# EAGLE design B008 - Xino RF v1.5 (EAGLE 6.1)
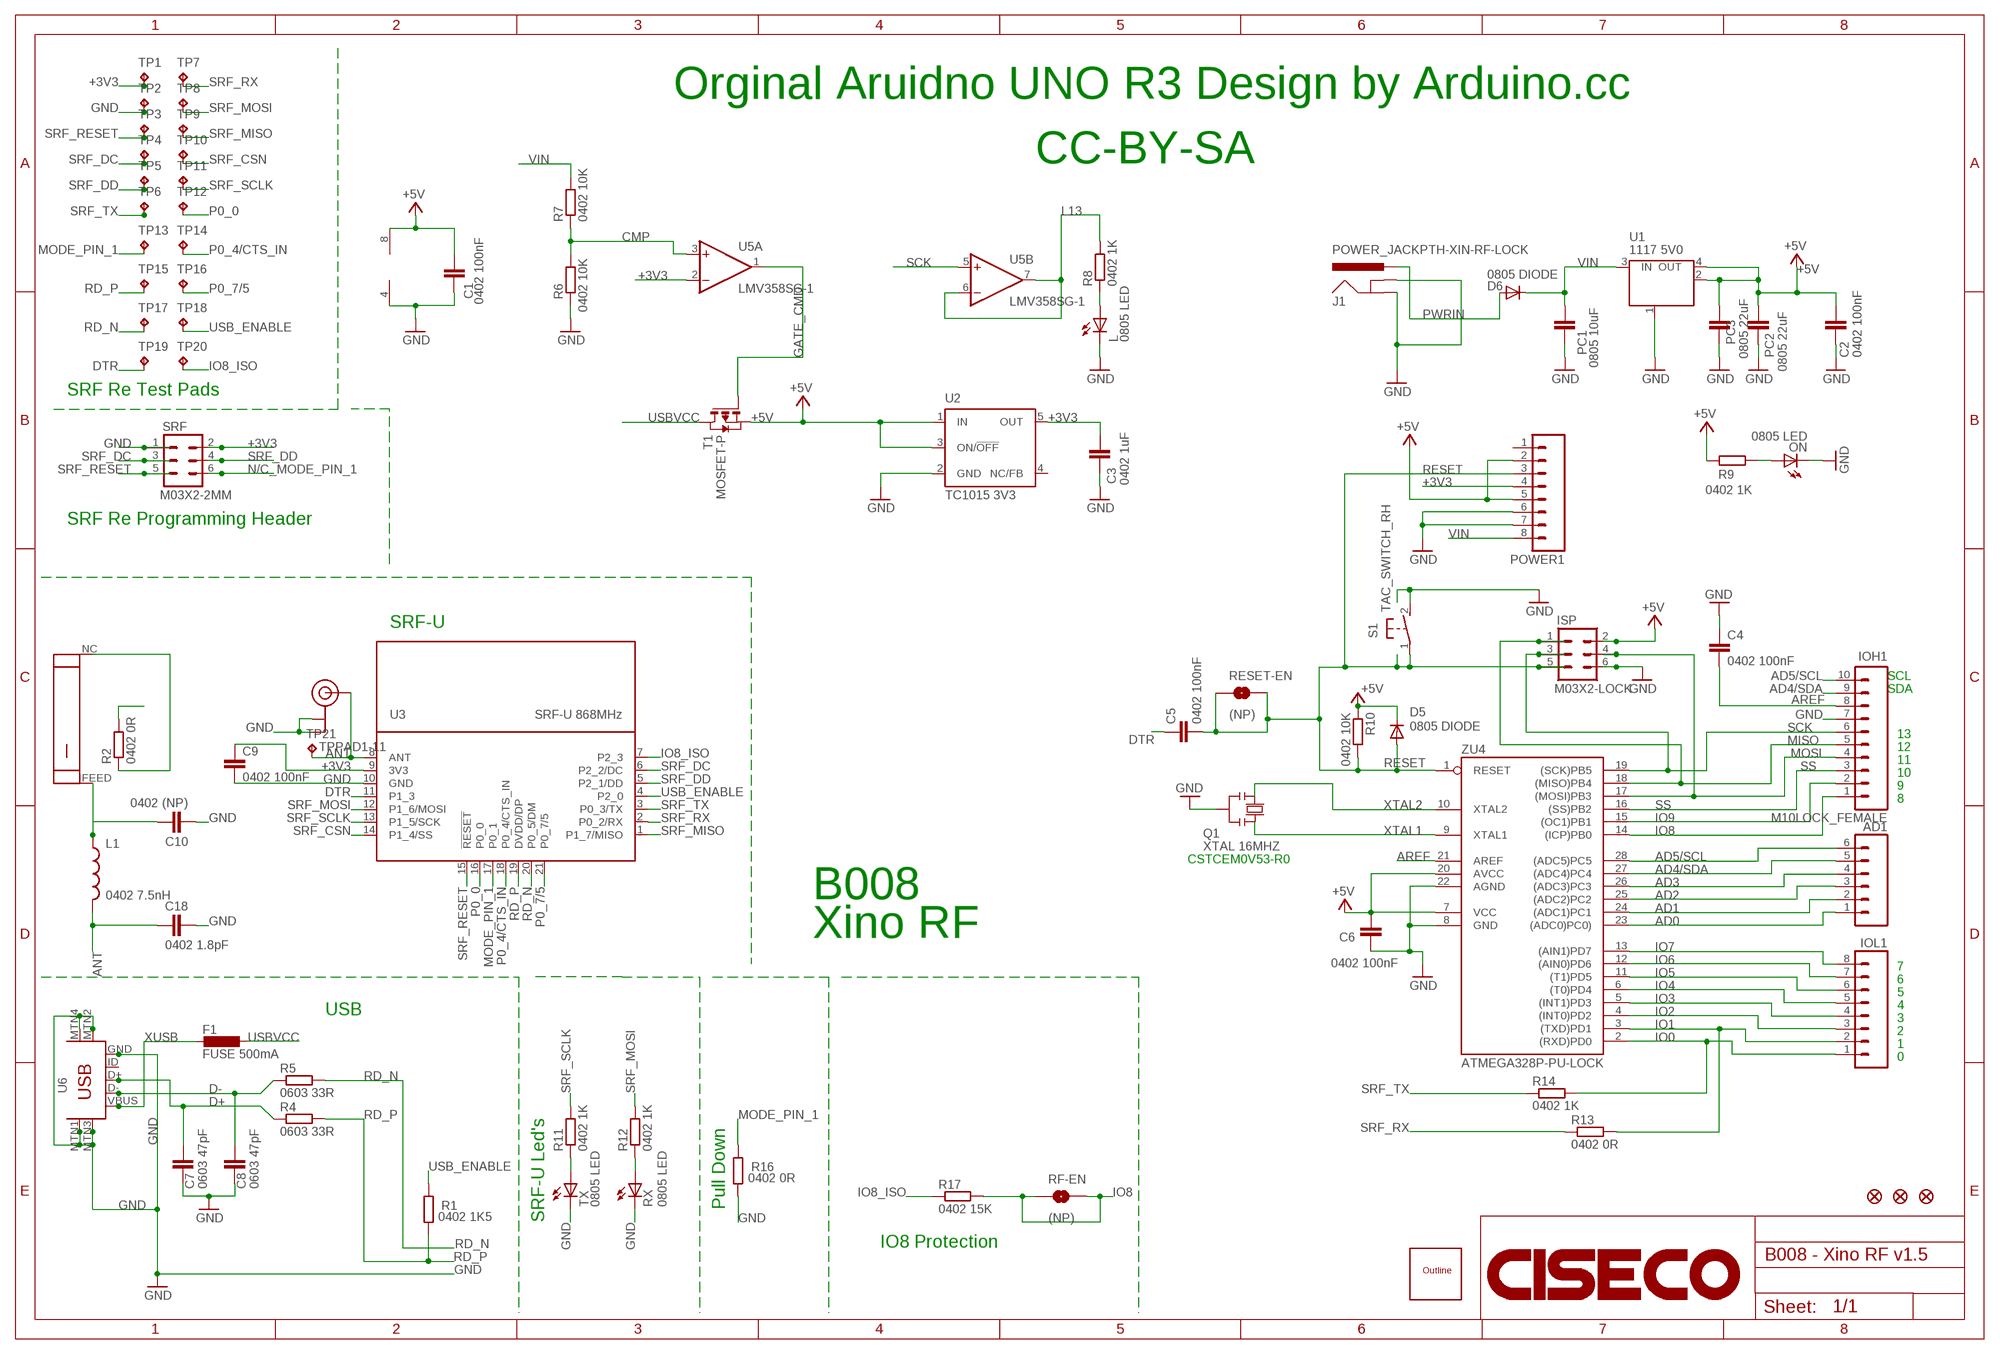
[diagram p0: schematic, sheet 1]

## Parts
AD1  M06LOCK_FEMALE  [1X06_LOCK_FEMALE]
C1  0402 100nF  C-EUC0402-SMALLER  [C0402-SMALLER]
C2  0402 100nF  C-EUC0402-SMALLER  [C0402-SMALLER]
C3  0402 1uF  C-EUC0402-SMALLER  [C0402-SMALLER]
C4  0402 100nF  C-EUC0402-SMALLER  [C0402-SMALLER]
C5  0402 100nF  C-EUC0402-SMALLER  [C0402-SMALLER]
C6  0402 100nF  C-EU0603-RND  [C0603-ROUND]
C7  0603 47pF  C-EUC0603K-SMALL  [C0603K-SMALL]
C8  0603 47pF  C-EUC0603K-SMALL  [C0603K-SMALL]
C9  0402 100nF  C-EUC0402-SMALLER  [C0402-SMALLER]
C10  0402 (NP)  C-EUC0402-SMALLER  [C0402-SMALLER]
C18  0402 1.8pF  C-EUC0402-SMALLER  [C0402-SMALLER]
D5  0805 DIODE  DIODE-0805  [0805-DIODE]
D6  0805 DIODE  DIODE-0805  [0805-DIODE]
F1  FUSE 500mA  L-EUL1812  [L1812]
FD1  FIDUCIAL1X2.5-STOP  [FIDUCIAL-1X2.5-STOP]
FD2  FIDUCIAL1X2.5-STOP  [FIDUCIAL-1X2.5-STOP]
FD3  FIDUCIAL1X2.5-STOP  [FIDUCIAL-1X2.5-STOP]
IOH1  M10LOCK_FEMALE  [1X10_LOCK_FEMALE]
IOL1  M08LOCK_FEMALE  [1X08_LOCK_FEMALE]
ISP  M03X2-LOCK  [2X3_LOCK]
J1  POWER_JACKPTH-XIN-RF-LOCK  [POWER_JACK_PTH_XINO_RF_LOCK]
L  0805 LED  LED0805-1206  [LED-0805-1206]
L1  0402 7.5nH  INDUCTOR0402-SMALLER  [C0402-SMALLER]
ON  0805 LED  LED0805-1206  [LED-0805-1206]
PC1  0805 10uF  C-EUC0805K  [C0805K]
PC2  0805 22uF  C-EUC0805K  [C0805K]
PC3  0805 22uF  C-EUC0805K  [C0805K]
POWER1  M08LOCK_FEMALE  [1X08_LOCK_FEMALE]
Q1  XTAL 16MHZ  RESONATORMU  [RESONATOR]
R1  0402 1K5  R-EU_R0402-SMALLER  [R0402-SMALLER]
R2  0402 0R  R-EU_R0402-SMALLER  [R0402-SMALLER]
R4  0603 33R  R-EU_0603K-SMALL  [C0603K-SMALL]
R5  0603 33R  R-EU_0603K-SMALL  [C0603K-SMALL]
R6  0402 10K  R-EU_R0402-SMALLER  [R0402-SMALLER]
R7  0402 10K  R-EU_R0402-SMALLER  [R0402-SMALLER]
R8  0402 1K  R-EU_R0402-SMALLER  [R0402-SMALLER]
R9  0402 1K  R-EU_R0402-SMALLER  [R0402-SMALLER]
R10  0402 10K  R-EU_R0402-SMALLER  [R0402-SMALLER]
R11  0402 1K  R-EU_R0402-SMALLER  [R0402-SMALLER]
R12  0402 1K  R-EU_R0402-SMALLER  [R0402-SMALLER]
R13  0402 0R  R-EU_R0402-SMALLER  [R0402-SMALLER]
R14  0402 1K  R-EU_R0402-SMALLER  [R0402-SMALLER]
R16  0402 0R  R-EU_R0402-SMALLER  [R0402-SMALLER]
R17  0402 15K  R-EU_R0402-SMALLER  [R0402-SMALLER]
RESET-EN  (NP)  SOLDERJUMPERNO-SJ  [SJ]
RF-EN  (NP)  SOLDERJUMPERNO-SJ  [SJ]
RX  0805 LED  LED0805-1206  [LED-0805-1206]
S1  TAC_SWITCH_RH  [B3F-31XX]
SRF  M03X2-2MM  [2X3_2MM]
T1  MOSFET-P  PMOSSOT23  [SOT-23]
TP1  TPB1,27  [B1,27]
TP2  TPB1,27  [B1,27]
TP3  TPB1,27  [B1,27]
TP4  TPB1,27  [B1,27]
TP5  TPB1,27  [B1,27]
TP6  TPB1,27  [B1,27]
TP7  TPB1,27  [B1,27]
TP8  TPB1,27  [B1,27]
TP9  TPB1,27  [B1,27]
TP10  TPB1,27  [B1,27]
TP11  TPB1,27  [B1,27]
TP12  TPB1,27  [B1,27]
TP13  TPB1,27  [B1,27]
TP14  TPB1,27  [B1,27]
TP15  TPB1,27  [B1,27]
TP16  TPB1,27  [B1,27]
TP17  TPB1,27  [B1,27]
TP18  TPB1,27  [B1,27]
TP19  TPB1,27  [B1,27]
TP20  TPB1,27  [B1,27]
TP21  TPPAD1-11  [P1-11]
TX  0805 LED  LED0805-1206  [LED-0805-1206]
U1  1117 5V0  MC33269ST-3.3T3  [SOT223]
U2  TC1015 3V3  LP2985-XXDBVR33  [SOT23-DBV]
U3  SRF-U 868MHz  SRF-LANDING-NO-ANT-1.2  [SRF-LANDING-NO-ANT-1.2]
U4  JTICHIPANT  JTICHIPANT-ROTATED  [JTICHIPANT-ROT]
U5  LMV358SG-1  LMV358MX  [SO08]
U6  USB-MINIB-5PIN  USB-MINIB-5PIN-TWEAKED  [USB-MINIB-CISECO-1]
U11  U.FL (NP)  U.FL  [U.FL]
U$1  CISECO-MEDIUM  [CISECO-1.3MM]
U$2  ARDUINO-OUTLINE-MILL-VSCORE  [ARDUINO-OUTLINE-MILL-VSCORE]
U$3  CISECO-LARGE  [CISECO-4MM]
ZU4  ATMEGA328P-PU-LOCK  [DIL28-3-LOCK]

## Nets
+3V3: C3.2 C9.1 POWER1.4 SRF.2 TP1.TP U2.5(OUT) U3.9(3V3) U5.2(A:-IN)
+5V [usbvcc]: C1.2 C2.2 C6.2 D5.C ISP.2 PC2.1 PC3.1 POWER1.2 POWER1.5 R9.2 R10.1 T1.2(S) U1.2(OUT) U1.4(OUT) U2.1(IN) U2.3(ON/!OFF) U5.8(P:V+) ZU4.7(VCC) ZU4.20(AVCC)
AD0: AD1.1 ZU4.23((ADC0)PC0))
AD1: AD1.2 ZU4.24((ADC1)PC1)
AD2: AD1.3 ZU4.25((ADC2)PC2)
AD3: AD1.4 ZU4.26((ADC3)PC3)
AD4/SDA: AD1.5 IOH1.9 ZU4.27((ADC4)PC4)
AD5/SCL: AD1.6 IOH1.10 ZU4.28((ADC5)PC5)
ANT [ANT]: C18.1 L1.2 TP21.TP U3.8(ANT) U11.P$3(SIGNAL)
AREF [aref]: C4.2 IOH1.8 ZU4.21(AREF)
CMP: R6.2 R7.1 U5.3(A:+IN)
D+: C7.1 R4.1 U6.D+
D-: C8.1 R5.1 U6.D-
DTR: C5.1 TP19.TP U3.11(P1_3)
GATE_CMD: T1.3(G) U5.1(A:OUT)
GND [gnd]: C1.1 C2.1 C3.1 C4.1 C6.1 C7.2 C8.2 C9.2 C10.1 C18.2 IOH1.7 ISP.6 J1.GND J1.GNDBREAK L.C ON.C PC1.2 PC2.2 PC3.2 POWER1.6 POWER1.7 Q1.2 R6.1 R16.1 RX.C S1.2(S) SRF.1 TP2.TP TX.C U1.1(GND/ADJ) U2.2(GND) U3.10(GND) U5.4(P:V-) U6.GND U6.MTN1(MTN2) U6.MTN2(MTN3) U6.MTN3(MTN1) U6.MTN4 U11.P$1(GND) U11.P$2(GND) ZU4.8(GND) ZU4.22(AGND)
IO0: IOL1.1 R14.2 ZU4.2((RXD)PD0)
IO1: IOL1.2 R13.2 ZU4.3((TXD)PD1)
IO2: IOL1.3 ZU4.4((INT0)PD2)
IO3: IOL1.4 ZU4.5((INT1)PD3)
IO4: IOL1.5 ZU4.6((T0)PD4)
IO5: IOL1.6 ZU4.11((T1)PD5)
IO6: IOL1.7 ZU4.12((AIN0)PD6)
IO7: IOL1.8 ZU4.13((AIN1)PD7)
IO8: IOH1.1 R17.2 RF-EN.1 RF-EN.2 ZU4.14((ICP)PB0)
IO8_ISO: R17.1 TP20.TP U3.7(P2_3)
IO9: IOH1.2 ZU4.15((OC1)PB1)
L13: R8.2 U5.6(B:-IN) U5.7(B:OUT)
MISO: IOH1.5 ISP.1 ZU4.18((MISO)PB4)
MODE_PIN_1: R16.2 TP13.TP U3.17(P0_1)
MOSI: IOH1.4 ISP.4 ZU4.17((MOSI)PB3)
N$1: L.A R8.1
N$3: ON.A R9.1
N$11: R2.2
N$35: R12.1 RX.A
N$36: R11.1 TX.A
N$39 [power]: C10.2 L1.1 U4.FEED
N$40: R2.1 U4.NC
N/C_MODE_PIN_1: SRF.6
P0_0: TP12.TP U3.16(P0_0)
P0_4/CTS_IN: TP14.TP U3.18(P0_4/CTS_IN)
P0_7/5: TP16.TP U3.21(P0_7/5)
PWRIN [power]: D6.A J1.PWR
RD_N [usb]: R5.2 TP17.TP U3.20(P0_5/DM)
RD_P [usb]: R1.1 R4.2 TP15.TP U3.19(DVDD/DP)
RESET: C5.2 D5.A ISP.5 POWER1.3 R10.2 RESET-EN.1 RESET-EN.2 S1.1(P) ZU4.1(RESET)
SCK: IOH1.6 ISP.3 U5.5(B:+IN) ZU4.19((SCK)PB5)
SRF_CSN: TP10.TP U3.14(P1_4/SS)
SRF_DC: SRF.3 TP4.TP U3.6(P2_2/DC)
SRF_DD: SRF.4 TP5.TP U3.5(P2_1/DD)
SRF_MISO: TP9.TP U3.1(P1_7/MISO)
SRF_MOSI: R12.2 TP8.TP U3.12(P1_6/MOSI)
SRF_RESET: SRF.5 TP3.TP U3.15(!RESET)
SRF_RX: R13.1 TP7.TP U3.2(P0_2/RX)
SRF_SCLK: R11.2 TP11.TP U3.13(P1_5/SCK)
SRF_TX: R14.1 TP6.TP U3.3(P0_3/TX)
SS: IOH1.3 ZU4.16((SS)PB2)
USB_ENABLE: R1.2 TP18.TP U3.4(P2_0)
USBVCC [usbvcc]: F1.1 T1.1(D)
VIN [power]: D6.C PC1.1 POWER1.8 R7.2 U1.3(IN)
XTAL1: Q1.3 ZU4.9(XTAL1)
XTAL2: Q1.1 ZU4.10(XTAL2)
XUSB [usbvcc]: F1.2 U6.VBUS
Unconnected: POWER1.1 U2.4(NC/FB) U6.ID

## Notes on the sheet
- Orginal Aruidno UNO R3 Design by Arduino.cc
- CC-BY-SA
- SRF Re Test Pads
- SRF Re Programming Header
- SRF-U
- SCL
- SDA
- 13
- 12
- 11
- 10
- 9
- 8
- CSTCEM0V53-R0
- B008
- Xino RF
- 7
- 6
- 5
- 4
- USB
- 3
- 2
- 1
- 0
- U6
- Pull Down
- SRF-U Led's
- IO8 Protection

## Library data of the parts
AD1 = CISECO eaglecad designs:M06: Header 6 Standard 6-pin 0.1" header. Use with straight break away headers (SKU : PRT-00116), right angle break away headers (PRT-00553), swiss pins (PRT-00743), machine pins (PRT-00117), and female headers (PRT-00115). Molex polarized connector foot print use with SKU : PRT-08094 with associated crimp pins and housings. NOTES ON THE VARIANTS LOCK and LOCK_LONGPADS... This footprint was designed to help hold the alignment of a through-hole component (i.e. 6-pin header) while soldering it into place. You may notice that each hole has been shifted either up or down by 0.005 of an inch from it's more standard position (which is a perfectly straight line). This slight alteration caused the pins (the squares in the middle) to touch the edges of the holes. Because they are alternating, it causes a "brace" to hold the component in place. 0.005 has proven to be the perfect amount of "off-center" position when using our standard breakaway headers. Although looks a little odd when you look at the bare footprint, once you have a header in there, the alteration is very hard to notice. Also, if you push a header all the way into place, it is covered up entirely on the bottom side. This idea of altering the position of holes to aid alignment will be further integrated into the Sparkfun Library for other footprints. It can help hold any component with 3 or more connection pins.
C1-C5 C7-C10 C18 PC1-PC3 = CISECO eaglecad designs:C-EU: CAPACITOR, European symbol
C6 = SmartPrj:C-EU: CAPACITOR, European symbol
D5 D6 = CISECO eaglecad designs:DIODE-: DIODE
F1 = rcl:L-EU: INDUCTOR, European symbol
FD1-FD3 = CISECO eaglecad designs:FIDUCIAL: Fiducial Alignment Points Various fiducial points for machine vision alignment.
IOH1 = CISECO eaglecad designs:M10: Header 10 Standard 10-pin 0.1" header. Use with straight break away headers (SKU : PRT-00116), right angle break away headers (PRT-00553), swiss pins (PRT-00743), machine pins (PRT-00117), and female headers (PRT-00115).
IOL1 POWER1 = CISECO eaglecad designs:M08: Header 8 Standard 8-pin 0.1" header. Use with straight break away headers (SKU : PRT-00116), right angle break away headers (PRT-00553), swiss pins (PRT-00743), machine pins (PRT-00117), and female headers (PRT-00115).
ISP SRF = CISECO eaglecad designs:M03X2
J1 = CISECO eaglecad designs:POWER_JACK: Power Jack This is the standard 5.5mm barrel jack for power. The PTH is the most common, proven, reliable, footprint. All others are experimental. The Slot footprint only works if the mill layer is transmitted to the PCB fab house so be warned. Spark Fun Electronics SKU : PRT-00119. Mating wall wart : TOL-00298 (and others)
L ON RX TX = CISECO eaglecad designs:LED: LEDs Standard schematic elements and footprints for 5mm, 3mm, 1206, and 0603 sized LEDs. 5mm - Spark Fun Electronics SKU : COM-00529 (and others)
L1 = CISECO eaglecad designs:INDUCTOR: Inductors Basic Inductor/Choke - 0603 and 1206. Footprints are not proven and vary greatly between part numbers.
Q1 = SmartPrj:RESONATOR
R1 R2 R4-R14 R16 R17 = CISECO eaglecad designs:R-EU_: RESISTOR, European symbol
RESET-EN RF-EN = CISECO eaglecad designs:SOLDERJUMPER: Solder Jumper Standard SMD solder jumper. Used to automate production. Two varients : Normally Open and Normally Closed are the same, but have different paste layers. NC will have a large amount of paste and should jumper during reflow.
S1 = CISECO eaglecad designs:TAC_SWITCH_RH
T1 = zetex:PMOSSOT23: MOS FET; OC_FARNELL: unknown; OC_NEWARK: unknown
TP1-TP20 = testpad:TP: Test pad
TP21 = CISECO eaglecad designs:TP: Test pad
U1 = CISECO eaglecad designs:MC33269ST*: Adjustable Output Low Dropout Voltage Regulator 800 mA Source: http://www.onsemi.com/pub/Collateral/MC33269-D.PDF LWK adjust for xino RF slik
U2 = SmartPrj:LP2985-XXDBVR: ULTRALOW-POWER 50-mA LOW-DROPOUT LINEAR REGULATORS 50-mA Low-Dropout Regulator Source: http://focus.ti.com/lit/ds/symlink/tps77001.pdf
U3 = Ciseco Footprints:SRF: SRF Wireless UART Serial Data Module. www.ciseco.co.uk
U4 = CISECO eaglecad designs:JTICHIPANT
U5 = linear:LMV358?*: Dual General Purpose, Low Voltage, Rail-to-Rail Output Operational Amplifiers Source: http://www.national.com/mpf/LM/LMV321.html http://www.national.com/dt/lmv_qual.pdf
U6 = CISECO eaglecad designs:USB-MINIB: Mini-USB "B" connector with 5th pin broken out. Created new symbol breaking out 5th "ID" pin in mini/micro USB connector spec. See: http://en.wikipedia.org/wiki/Mini_usb#Cables. Uses same footprint as 4-pin symbol. Also added pins to connect to mounting / shield pads if required (probably not generally needed as signals aren't shielded once they leave the connector). Modified by Ciseco for Rapid Part 24-0357
U11 = CISECO eaglecad designs:U.FL
U$1 U$3 = CISECO eaglecad designs:CISECO
U$2 = CISECO eaglecad designs:ARDUINO-OUTLINE
ZU4 = CISECO eaglecad designs:ATMEGA328P-: MICROCONTROLLER 4 Kbytes FLASH 128 bytes SRAM 256 bytes EEPROM UART 6-channel 10 bit ADC

## Net classes
0 default: width 0.254 mm, clearance 0.254 mm
1 power: width 0.61 mm, drill 0.406 mm, clearance 0.254 mm
2 gnd: width 0.305 mm, drill 0.254 mm, clearance 0.254 mm
3 usbvcc: width 0.508 mm, drill 0.406 mm, clearance 0.254 mm
4 aref: width 0.406 mm, drill 0.406 mm, clearance 0.254 mm
5 usb: width 0.254 mm, clearance 0.254 mm
6 ANT: width 0.61 mm, drill 0.254 mm, clearance 0.381 mm

## Board
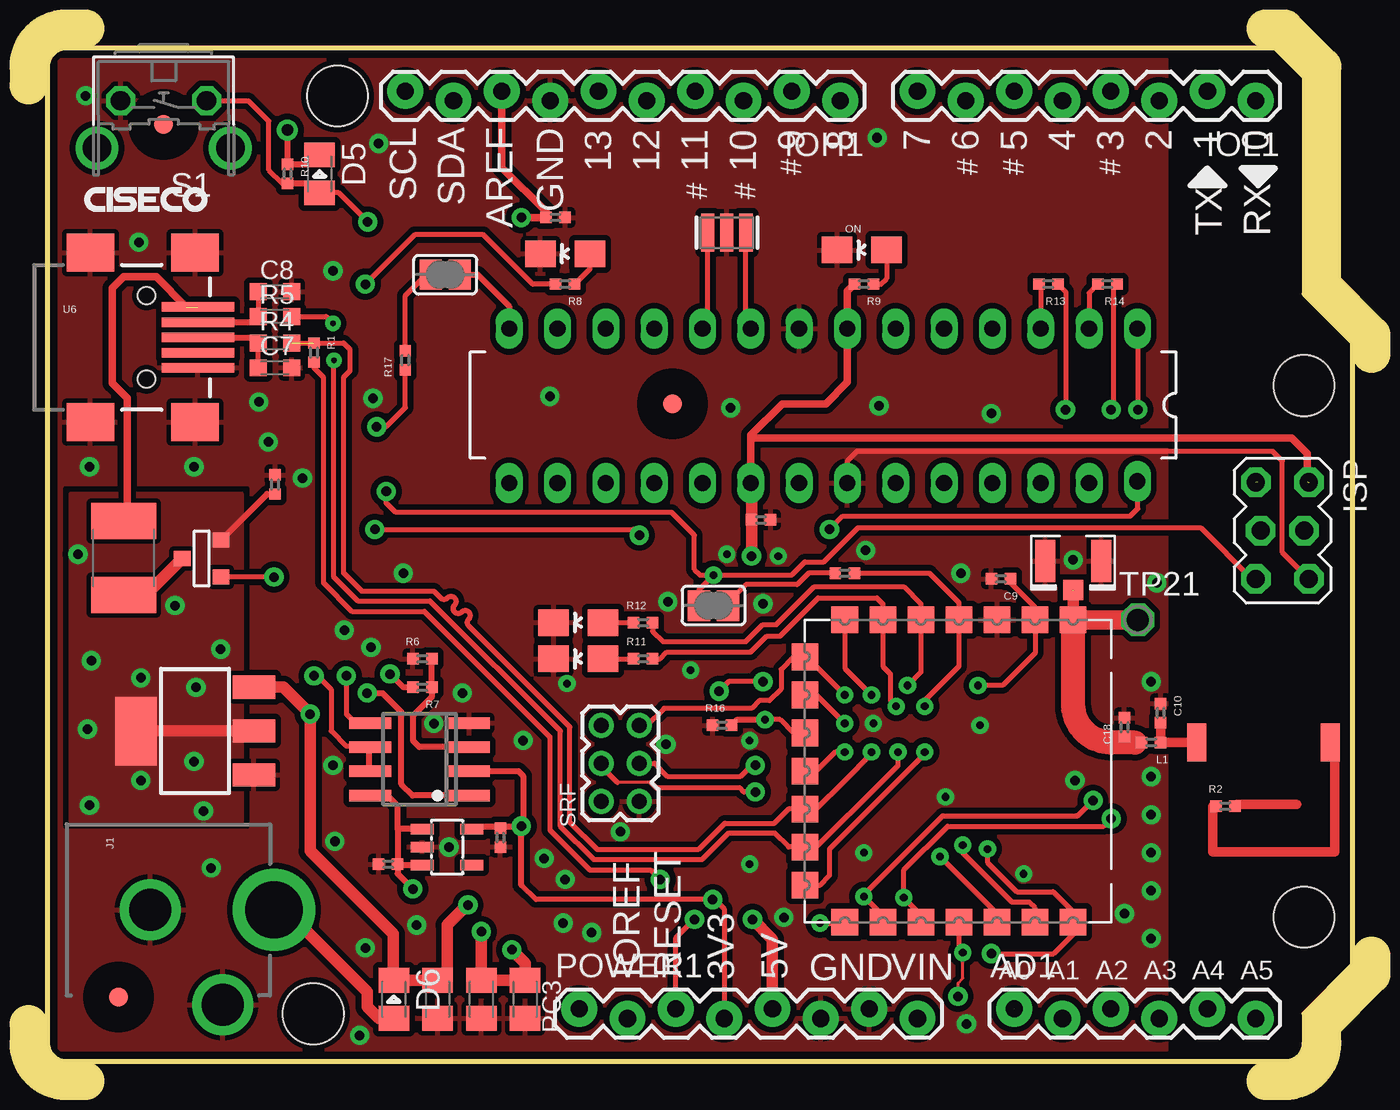
[diagram p1: board, top side]
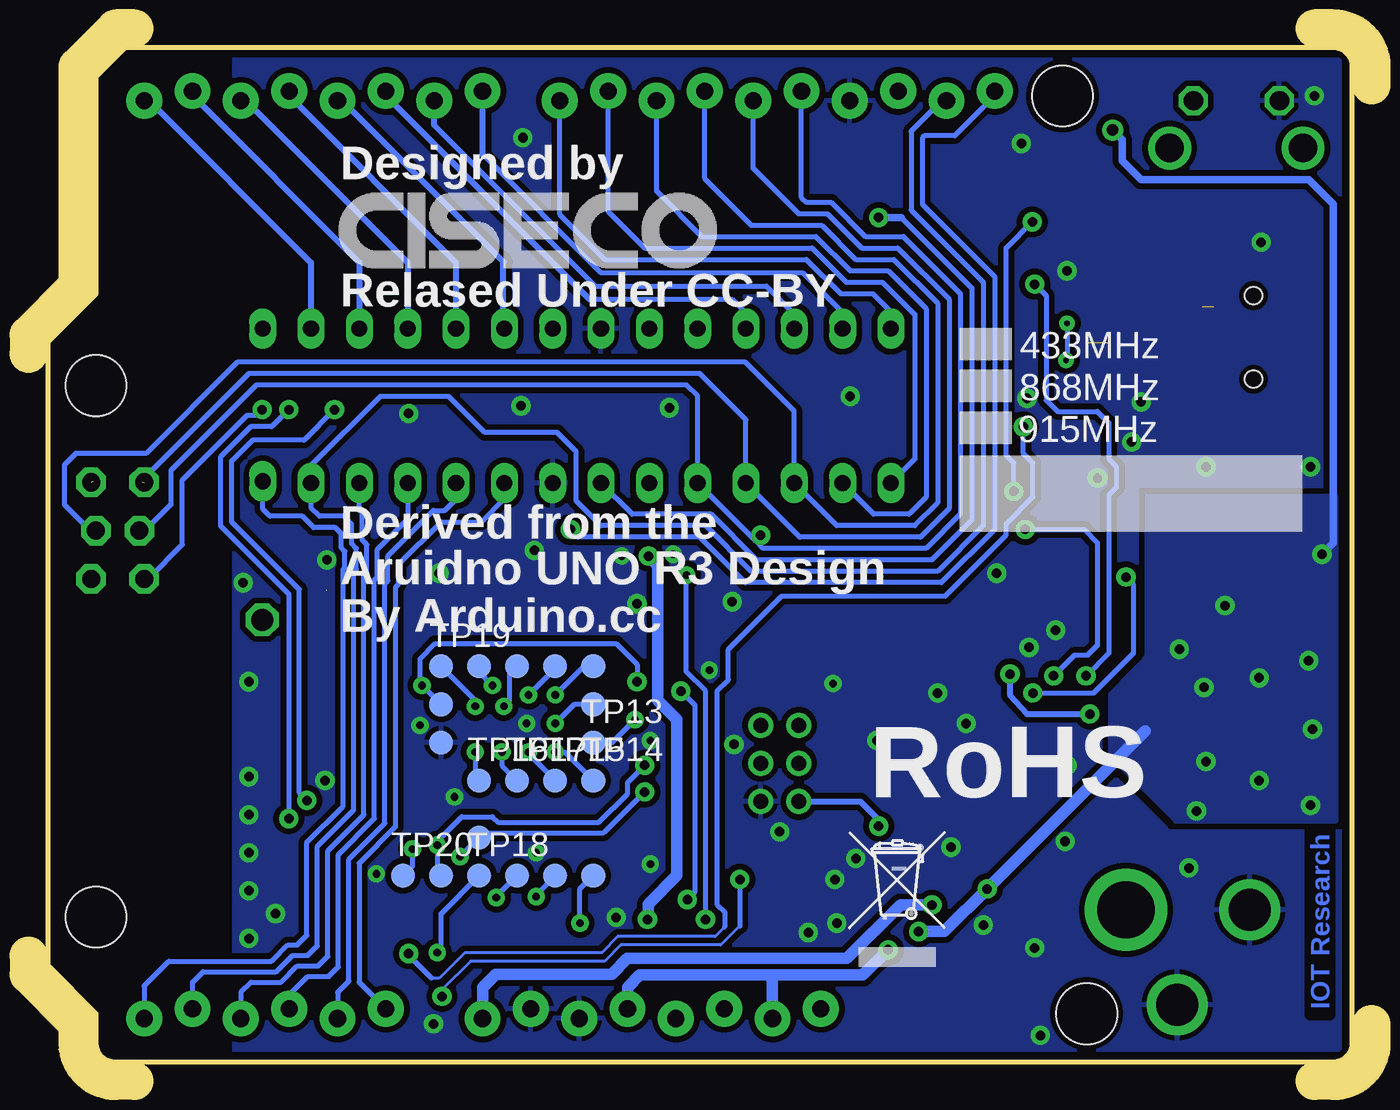
[diagram p2: board, bottom side, seen from below]

Size 68.58 x 53.34 mm. Coordinates in mm from the lower left corner, seen from the top.
Copper layers (1*16): Top 0.035mm / dielectric 1.5mm / Bottom 0.035mm
Design rules: minimum track width 0.15mm, minimum drill 0.299mm, track to track 10mil, track to pad 10mil, pad to pad 10mil, via to via 12mil, smd to smd 0mil, copper to edge 0.04mm, drill to drill 0.15mm, minimum pad ring 10mil, minimum via ring 10mil, stop-mask expansion 1mil, vias tented up to drill 30mil, thermal gap 10mil
vRestrict: area 22.9,44.1 to 24.6,49.1; area 25.4,45.5 to 27.1,49.1; area 28.4,45.3 to 29.6,48.8; area 31,45.3 to 32.1,48.8; area 33.5,45.3 to 34.7,48.8; area 36.1,45.3 to 37.2,48.8; area 38.7,47.2 to 39.9,48.8; area 60.3,44.2 to 61.7,46.7; area 62.9,44.2 to 64.3,46.7; area 37.6,42 to 41.1,43.4; area 0.6,21.8 to 2,30.1; area 5.7,22.6 to 7.4,30.1; area 11.3,28.8 to 12.7,31.1; area 44.8,47.5 to 46.1,48.9; area 47.6,47.4 to 48.8,48.9; area 50.2,47.4 to 51.3,48.9; area 52.8,47.4 to 54,48.9; area 55.2,47.4 to 56.4,48.9; area 57.9,47.4 to 59.1,48.9; area 60.5,47.4 to 61.6,48.9; area 63,47.4 to 64.1,48.9; area 41.3,47.2 to 42.4,48.8; area 0.3,12.4 to 9.4,24.5

### Footprints (pad centres in the part's own frame; a part is rotated, then mirrored left to right if it is on the bottom)
1X06_LOCK_FEMALE = drill 0.9 pad 1.88: 1 0,0.254; 2 2.54,-0.254; 3 5.08,0.254; 4 7.62,-0.254; 5 10.16,0.254; 6 12.7,-0.254
C0402-SMALLER = smd 0.6 x 0.6: 1 -0.5,0; 2 0.5,0
C0603K-SMALL = smd 0.889 x 0.889: 1 -0.875,0; 2 0.875,0
0805-DIODE = smd 1.3 x 1.6: A 1,0; C -1,0
L1812 = smd 1.9 x 3.4: 1 -1.95,0; 2 1.95,0
FIDUCIAL-1X2.5-STOP = smd 1 x 1: 1 0,0
1X10_LOCK_FEMALE = drill 0.9 pad 1.88: 1 0,0.254; 2 2.54,-0.254; 3 5.08,0.254; 4 7.62,-0.254; 5 10.16,0.254; 6 12.7,-0.254; 7 15.24,0.254; 8 17.78,-0.254; 9 20.32,0.254; 10 22.86,-0.254
1X08_LOCK_FEMALE = drill 0.9 pad 1.88: 1 0,0.254; 2 2.54,-0.254; 3 5.08,0.254; 4 7.62,-0.254; 5 10.16,0.254; 6 12.7,-0.254; 7 15.24,0.254; 8 17.78,-0.254
2X3_LOCK = drill 0.95 pad 1.55 octagon: 1 -2.54,-1.397; 2 -2.54,1.397; 3 0,-1.143; 4 0,1.143; 5 2.54,-1.397; 6 2.54,1.397
POWER_JACK_PTH_XINO_RF_LOCK = drill 2.2: GND 0,5.4; GNDBREAK 5,9.2 | drill 2.997 pad 4.318: PWR 0,11.9
LED-0805-1206 = smd 1.6 x 1.4: A 1.3,0; C -1.3,0
C0805K = smd 1.3 x 1.6: 1 -1,0; 2 1,0
RESONATOR = smd 0.7 x 2: 1 -1,0; 2 0,0; 3 1,0
R0402-SMALLER = smd 0.6 x 0.6: 1 -0.5,0; 2 0.5,0
SJ = smd 1.168 x 1.6: 1 -0.762,0; 2 0.762,0
B3F-31XX = drill 1.016 octagon: 1 -2.261,-1.245; 2 2.261,-1.245 | drill 1.499 pad 2.159: 3 -3.505,1.245; 4 3.505,1.245
2X3_2MM = drill 0.8: 1 -2,-1; 2 -2,1; 3 0,-1; 4 0,1; 5 2,-1; 6 2,1
SOT-23 = smd 0.787 x 0.889: 1 0.025,-1.016; 2 -0.94,1.016; 3 0.991,1.016
B1,27 = smd 1.27 x 1.27: TP 0,0
P1-11 = drill 1.15 pad 1.676 octagon: TP 0,0
SOT223 = smd 1.219 x 2.235: 1 -2.311,-3.099; 2 0,-3.099; 3 2.311,-3.099 | smd 3.6 x 2.2: 4 0,3.099
SOT23-DBV = smd 0.55 x 1.2: 1 -0.95,-1.3; 2 0,-1.3; 3 0.95,-1.3; 4 0.95,1.3; 5 -0.95,1.3
SRF-LANDING-NO-ANT-1.2 = smd 1.4 x 1.4: 1 15.9,2; 2 15.9,4; 3 15.9,6; 4 15.9,8; 5 15.9,10; 6 15.9,12; 7 15.9,14; 8 0,14; 9 0,12; 10 0,10; 11 0,8; 12 0,6; 13 0,4; 14 0,2; 15 1.95,-0.1; 16 3.95,-0.1; 17 5.95,-0.1; 18 7.95,-0.1; 19 9.95,-0.1; 20 11.95,-0.1; 21 13.95,-0.1
JTICHIPANT-ROT = smd 1 x 2: FEED -3.51,0; NC 3.51,0
SO08 = smd 0.6 x 2.2: 1 -1.905,-2.6; 2 -0.635,-2.6; 3 0.635,-2.6; 4 1.905,-2.6; 5 1.905,2.6; 6 0.635,2.6; 7 -0.635,2.6; 8 -1.905,2.6
USB-MINIB-CISECO-1 = smd 3.8 x 0.5: D+ 7.9,0; D- 7.9,0.8; GND 7.9,-1.6; ID 7.9,-0.8; VBUS 7.9,1.6 | smd 2.5 x 2: MTN1 2.25,4.45; MTN2 7.75,4.45; MTN3 2.25,-4.45; MTN4 7.75,-4.45 | hole 0.9: 5.2,2.2; 5.2,-2.2
U.FL = smd 2.2 x 1.05: P$1 0,1.475; P$2 0,-1.475 | smd 1.05 x 1.05: P$3 1.525,0
ARDUINO-OUTLINE-MILL-VSCORE = hole 3.2: 66.04,35.56; 15.24,50.8; 13.97,2.54; 66.04,7.62
DIL28-3-LOCK = drill 0.85 pad 1.422 long: 1 -16.51,-4.01; 2 -13.97,-4.01; 3 -11.43,-4.01; 4 -8.89,-4.01; 5 -6.35,-4.01; 6 -3.81,-4.01; 7 -1.27,-4.01; 8 1.27,-4.01; 9 3.81,-4.01; 10 6.35,-4.01; 11 8.89,-4.01; 12 11.43,-4.01; 13 13.97,-4.01; 14 16.51,-4.01; 15 16.51,4.11; 16 13.97,4.11; 17 11.43,4.11; 18 8.89,4.11; 19 6.35,4.11; 20 3.81,4.11; 21 1.27,4.11; 22 -1.27,4.11; 23 -3.81,4.11; 24 -6.35,4.11; 25 -8.89,4.11; 26 -11.43,4.11; 27 -13.97,4.11; 28 -16.51,4.01

### Placement (x,y rotation side)
AD1  50.8,2.54 0 top
C1  17.9,10.4 0 top
C2  11.96,30.36 270 top
C3  23.8,11.8 90 top
C4  26.7,44.4 180 top
C5  41.9,25.7 180 top
C6  0402 100nF  [C0402-SMALLER]  37.5,28.5 180 top
C7  11.95,36.5 0 top
C8  11.95,40.5 0 top
C9  50.1,25.4 180 top
C10  58.5,18.35 270 top
C18  56.6,17.6 90 top
D5  14.3,46.7 270 top
D6  18.2,3.3 270 top
F1  4,26.5 90 top
FD1  6.1,49.3 0 top
FD2  32.85,34.6 0 top
FD3  3.73,3.41 0 top
IOH1  41.66,50.8 180 top
IOL1  63.5,50.8 180 top
ISP  64.9,27.94 270 top
J1  0,8 270 top
L  27.2,42.5 0 top
L1  58,16.8 180 top
ON  42.8,42.7 0 top
PC1  20.5,3.3 270 top
PC2  22.8,3.3 270 top
PC3  25.1,3.3 270 top
POWER1  27.94,2.54 0 top
Q1  35.7,43.6 0 top
R1  14,37.3 270 top
R2  61.9,13.45 0 top
R4  11.95,37.8 0 top
R5  11.95,39.2 0 top
R6  19.7,21.2 0 top
R7  19.7,19.7 180 top
R8  27.2,40.9 180 top
R9  42.9,40.9 180 top
R10  12.62,46.7 270 top
R11  31.3,21.2 0 top
R12  31.3,23.1 0 top
R13  52.6,40.9 180 top
R14  55.7,40.9 180 top
R16  35.45,17.7 0 top
R17  18.8,36.9 90 top
RESET-EN  35,24 180 top
RF-EN  20.9,41.4 0 top
RX  27.9,23.1 0 top
S1  6.1,49.3 180 top
SRF  30.1,15.7 90 top
T1  8.1,26.5 270 top
TP1  47.9,18.8 0 bottom
TP2  47.9,16.8 0 bottom
TP3  39.9,20.8 0 bottom
TP4  47.9,9.8 0 bottom
TP5  45.9,11.8 0 bottom
TP6  43.9,9.8 0 bottom
TP7  41.9,9.8 0 bottom
TP8  45.9,20.8 0 bottom
TP9  39.9,9.8 0 bottom
TP10  41.9,20.8 0 bottom
TP11  43.9,20.8 0 bottom
TP12  39.9,18.8 0 bottom
TP13  39.9,16.8 0 bottom
TP14  39.9,14.8 0 bottom
TP15  41.9,14.8 0 bottom
TP16  45.9,14.8 0 bottom
TP17  43.9,14.8 0 bottom
TP18  45.9,9.8 0 bottom
TP19  47.9,20.8 0 bottom
TP20  49.9,9.8 0 bottom
TP21  57.3,23.25 0 top
TX  27.9,21.2 0 top
U1  7.75,17.4 90 top
U2  21,11.3 270 top
U3  39.9,23.25 270 top
U4  63.9,16.8 0 top
U5  19.55,15.92 90 top
U6  0,38.1 0 top
U11  53.9,26.35 270 top
U$1  1.9,44.7 0 top
U$2  0,0 0 top
U$3  53.3,41.7 0 bottom
U$4  [WEEE-LOGO]  26.5,5 0 bottom
ZU4  40.77,34.54 180 top

### Tracks (layer width: path | path; a pad name or v marks a point on that pad's centre or on a via)
+3V3  (via drill 0.4, 0.5)
  Top 0.254: v48.9,19.8 50.2,19.8 51.9,21.5 U3.9 51.9,23.9 50.6,25.2 C9.1 | v37.6,20 35.8,20 v35.3,19.5 | POWER1.4 35.56,8.04 35.06,8.54 v34.96,8.54 25.66,8.54 24.9,9.3 | 25,12.3 v24.9,12.4 | C3.2 23.8,12.36
  Top 0.305: 24.9,12.36 23.8,12.36 22.39,12.36 22.39,12.34 U2.5 | 25,12.3 25,15.05 24.75,15.3 22.16,15.3 U5.2 | 24.9,9.3 24.9,12.36 | 24.9,12.36 v24.9,12.4
  Bottom 0.254: v37.6,20 37.6,20.9 38.7,22 48.2,22 49,21.2 49,19.9 v48.9,19.8 TP1.TP | v35.3,19.5 34.55,18.75 34.55,8.95 v34.96,8.54
  Bottom 0.305: v24.9,12.4 24.9,12.74 25.86,13.7 SRF.2
+5V  (via drill 0.5, 0.6)  (1 unrouted)
  Top 0.305: U5.8 17.85,14.02 18.4,13.46 18.4,12.25 | U2.1 18.4,12.25 | 18.4,12.25 C1.2 18.4,10.35 | U2.3 18.4,10.35 | D5.C 13.8,47.2 R10.1 12.62,48.98 v12.6,49 | 18.4,10.35 18.4,9.9 v19.2,9.1 | T1.2 11.54,29.86 C2.2
  Top 0.406: ZU4.20 36.96,32.8 | 36.96,32.8 36.96,32.96 38.6,34.6 40.9,34.6 42.04,35.74 ZU4.7 42.04,40.54 R9.2 | 36.96,32.8 65.4,32.8 66.2,32 66.2,30.51
  Top 0.61: C6.2 37,30.4 ZU4.20 | U1.2 U1.4 | v22.8,6.86 PC2.1 PC3.1 25.1,5.2 v24.4,5.9 | C6.2 37,28.53 | C6.2 v37,26.6 | v37.05,7.5 38.1,6.45 POWER1.5 38.1,2.6
  Bottom 0.305: v19.2,9.1 19.1,9.2
  Bottom 0.406: v12.6,49 12.1,48.5 12.1,47.4 11.1,46.4 2.3,46.4 1,45.1 1,27.3 v1.6,26.7
  Bottom 0.61: 30.73,4.57 37.47,4.57 38.1,3.94 POWER1.5 | 30.73,4.57 25.73,4.57 v24.4,5.9 | v22.8,6.86 21.44,6.86 19.1,9.2 10.9,17.4 | 30.73,4.57 30.48,4.32 POWER1.2 | v37,26.6 36.5,26.1 36.5,19 35.5,18 35.5,9.8 37,8.3 37,7.6 37.05,7.55 v37.05,7.5
  other vias: 6.7,24 7.8,19.7 4.9,20.2 4.9,14.8 7.7,15.8 2.1,17.5 2.3,21.1 2.2,13.5 8.2,13.2 9.1,21.7
  pour Bottom (isolate 0.406, no thermals): 0.89,29.72 10.79,29.72 10.79,21.34 12.7,19.43 12.7,16.13 9.27,12.7 0.89,12.7
  pour Top (no thermals): 1.27,12.7 1.27,29.84 10.16,29.84 10.16,12.7
AD0  (1 unrouted)
  Bottom 0.254: ZU4.23 44.58,29.62 45.8,28.4 47.9,28.4 50.15,26.15 50.15,25.1 50.3,24.95 50.3,12.35 52.2,10.45 52.2,4.2 AD1.1
AD1
  Bottom 0.254: ZU4.24 47.12,29.58 47.7,29 48.3,29 50.7,26.6 50.7,25.3 50.85,25.15 50.85,12.55 52.75,10.65 52.75,4.25 53.34,3.66 AD1.2
AD2
  Bottom 0.254: AD1.3 55.88,3.52 54.9,4.5 53.8,4.5 53.3,5 53.3,10.9 51.4,12.8 51.4,25.35 51.25,25.5 51.25,26.95 49.66,28.54 ZU4.25
AD3
  Bottom 0.254: ZU4.26 52.2,29 52.05,28.85 52.05,27.45 51.8,27.2 51.8,25.7 51.95,25.55 51.95,13 53.85,11.1 53.85,5.55 54.35,5.05 55.45,5.05 56.3,4.2 57.9,4.2 58.42,3.68 AD1.4
AD4/SDA
  Bottom 0.254: AD1.5 60.96,4.19 60.4,4.75 56.55,4.75 55.7,5.6 54.9,5.6 54.4,6.1 54.4,11.35 52.5,13.25 52.5,25.75 52.35,25.9 52.35,27 52.6,27.25 52.6,28.3 53,28.7 54.3,28.7 54.74,29.14 ZU4.27 54.74,31.36 51.1,35 47.5,35 45.6,33.1 41.8,33.1 40.8,32.1 40.8,29.5 39.5,28.2 34,28.2 31.6,25.8 21.8,25.8 19.4,28.2 19.4,41 23.2,44.8 23.2,48.94 21.59,50.55 IOH1.9
AD5/SCL  (via drill 0.5)
  Top 0.254: v41.1,28 41.8,28.7 56.9,28.7 57.3,29.1 57.3,30.51 ZU4.28
  Bottom 0.254: v41.1,28 40.7,27.6 34.3,27.6 31.9,25.2 21.6,25.2 18.8,28 18.8,41.3 22.6,45.1 22.6,48.6 22.5,48.7 20.9,48.7 18.8,50.8 IOH1.10 | ZU4.28 57.27,30.53 57.27,29.07 56.9,28.7 55.2,28.7 54.6,28.1 53.45,28.1 53.15,27.8 53.15,27.05 52.95,26.85 52.95,26 53.05,25.9 53.05,13.45 54.95,11.55 54.95,6.65 55.45,6.15 55.95,6.15 56.8,5.3 62.2,5.3 63.5,4 AD1.6
ANT  (1 unrouted)
  Top 0.5: L1.2 57.15,16.8 56.65,16.8 56.6,16.85 C18.1
  Top 0.61: U3.8 53.9,24.8
  Top 1.016: TP21.TP U3.8
  Top 1.27: 57.15,16.8 55.9,16.8 arc-90 53.9,18.8 U3.8
AREF  (via drill 0.5)
  Top 0.406: v24.9,44.4 C4.2 26.2,44.7 23.88,47.02 IOH1.8
  Bottom 0.254: 23.7,44.4 20,40.7 20,28.5 22.1,26.4 31.3,26.4 33.7,28.8 37.86,28.8 ZU4.21
  Bottom 0.406: 23.7,44.4 v24.9,44.4
CMP
  Top 0.305: U5.3 19.55,16.55 19.2,16.9 19.2,18.2 20.2,19.2 R7.1 R6.2
D+
  Top 0.254: C7.1 R4.1
  Top 0.305: U6.D+ 10.78,38.1 R4.1
D-
  Top 0.254: C8.1 R5.1
  Top 0.305: U6.D- 10.78,38.9 R5.1
DTR  (via drill 0.4)
  Top 0.254: v46.1,18.7 46.1,19 TP19.TP U3.11 47.9,24.15 46.35,25.7 C5.1
  Bottom 0.254: v46.1,18.7 46.1,19 TP19.TP
GATE_CMD  (via drill 0.5)
  Top 0.254: v11.9,25.5 T1.3
  Top 0.305: U5.1 19.18,14.02 18.6,14.6 18.6,18.4 17.6,19.4 v16.8,19.4
  Bottom 0.254: v16.8,19.4 13.6,19.4 11.5,21.5 11.5,25.1 v11.9,25.5
GND  (via drill 0.4, 0.5)
  Top 0.254: ISP.6 64.9,26.79 64.9,31.6 64.4,32.1 42.54,32.1 42.04,31.6 ZU4.22
  other vias: 37.6,24.1 2,50.8 48,25.7 49.6,34.1 43.7,34.5 26.4,35 15,15.6 15.1,11.6 21.1,11.3 19.4,7.2 8.6,10.2 7.7,31.3 11.1,34.7 42.9,11 20.3,17.8 32.6,24.2 15,41.6 15.6,22.7 18.7,25.7 30.1,12.1 27.1,7.3 27.2,9.6 26.1,10.7 4.8,43.1 43.6,48.6 47.2,13.94 56.6,7.8 48.3,2 28.6,6.8 17.4,48.3 35.9,34.4 21.8,19.4 38.7,7.6 32.5,16.7 2.2,31.3 16.4,1.4 36.9,16.9 43.4,17.8 49,17.7 25,16.9 35.7,26.7 33.8,20.6 38.4,26.6 27.3,19.9 17,21.8 17.1,34.9 11.6,32.6 13.4,30.7 43,26.9 16.7,6 36.9,10.4 51.3,9.89 58,6.5 58,9 58,11 58,13 58,15 58,20 58.3,25.2 53.9,26.4 54,14.8
  pour Bottom (isolate 0.305, rank 2): 0.64,52.7 58.8,52.7 58.8,0.64 0.64,0.64
  pour Top (isolate 0.305, rank 2): 0.64,52.7 58.8,52.7 58.8,0.64 0.64,0.64
IO0
  Top 0.254: ZU4.2 54.74,40.44 R14.2
  Bottom 0.305: ZU4.2 54.74,42.04 63.25,50.55 IOL1.1
IO1
  Top 0.254: R13.2 52.2,40.9 ZU4.3
  Bottom 0.305: ZU4.3 52.2,42.04 60.96,50.8 IOL1.2
IO2
  Bottom 0.305: ZU4.4 49.66,42.04 58.17,50.55 IOL1.3
IO3
  Bottom 0.305: ZU4.5 47.12,42.04 55.88,50.8 IOL1.4
IO4
  Bottom 0.305: 44.62,42.08 44.6,42.06 | ZU4.6 44.62,38.55 44.62,42.08 | 44.62,42.08 53.09,50.55 IOL1.5
IO5
  Bottom 0.254: 40.1,40.1 32.6,40.1 31.88,39.38 ZU4.11
  Bottom 0.305: 40.1,40.1 50.8,50.8 IOL1.6
IO6
  Bottom 0.254: ZU4.12 29.34,39.34 30.8,40.8 39.8,40.8 48.26,49.26
  Bottom 0.305: 48.26,49.26 IOL1.7
IO7
  Bottom 0.254: ZU4.13 26.8,39.4 28.9,41.5 39.5,41.5 45.72,47.72
  Bottom 0.305: 45.72,47.72 IOL1.8
IO8
  Top 0.254: 19.9,41.4 18.8,40.3 R17.2
  Top 0.305: 19.9,41.4 RF-EN.1 RF-EN.2 22.6,41.4 24.26,39.74 ZU4.14
  Bottom 0.254: ZU4.14 24.26,39.46 25.2,40.4 26.9,40.4 28.7,42.2 39.3,42.2 41.66,44.56 IOH1.1
IO8_ISO  (via drill 0.4, 0.5)
  Top 0.254: v49.6,5.7 52.88,5.7 53.9,6.72 U3.7 53.9,7.9 52.85,8.95 50.95,8.95 49.4,10.5 v49.4,11.2 | v17.3,33.4 17.8,33.4 18.8,34.4 R17.1
  Bottom 0.15: 33,7.1 33.5,6.6 38.6,6.6 39.45,5.75 46.65,5.75 48,4.4 48.4,4.4
  Bottom 0.254: v17.3,33.4 17.3,32 16.8,31.5 16.8,29.7 18.2,28.3 18.2,27.7 21.4,24.5 30,24.5 32.8,21.7 32.8,20.1 33.4,19.5 33.4,8.3 33,7.9 33,7.1 | 48.4,4.4 49.6,5.6 v49.6,5.7 | TP20.TP 49.4,10.3 v49.4,11.2
IO9
  Bottom 0.254: ZU4.15 23,31.69 23,39.3 24.7,41 26.6,41 28.4,42.8 37.2,42.8 39.12,44.72 IOH1.2
L13  (via drill 0.5)
  Top 0.254: v14,20.3 14.2,20.3 14.9,19.6 14.9,17.4 15.7,16.6 16.9,16.6 | v16.7,40.9 19.3,43.5 22.9,43.5 25.5,40.9 R8.2
  Top 0.305: U5.7 16.9,15.34 16.9,16.6 16.91,16.6 U5.6
  Bottom 0.254: v16.7,40.9 16.1,40.3 16.1,34.8 15.5,34.2 13.4,34.2 12.8,33.6 12.8,31.7 12.4,31.3 12.4,30.2 12.8,29.8 12.8,21.5 v14,20.3
MISO  (1 unrouted)
  Bottom 0.254: 63.6,30.51 63.6,30.6 58,36.2 34.3,36.2 31.88,33.78 ZU4.18 29.04,27.6 22.7,27.6 21.2,29.1 21.2,40.1 23.9,42.8 25.8,42.8 27.6,44.6 29.1,44.6 31.5,47 IOH1.5
MODE_PIN_1  (via drill 0.4)
  Top 0.254: U3.17 39.2,17.3 38.5,18 v37.7,18 37.4,18
  Top 0.305: v37.7,18 36.25,18 R16.2
  Bottom 0.254: TP13.TP 38.9,16.8 v37.7,18
MOSI
  Bottom 0.254: IOH1.4 34.04,46.44 31.6,44 27.9,44 26.1,42.2 24.1,42.2 21.8,39.9 21.8,29.4 23,28.2 27.1,28.2 ZU4.17 29.34,34.24 31.9,36.8 58.6,36.8 63.4,32 67.1,32 67.7,31.4 67.7,29.3 66.34,27.94 ISP.4
N$1
  Top 0.254: L.A 28.5,41.69 R8.1
N$3
  Top 0.254: ON.A 44.1,41.2 43.8,40.9 R9.1
N$11
  Top 0.5: R2.2 62.5,13.55 65.65,13.55
N$35
  Top 0.254: RX.A R12.1
N$36
  Top 0.254: TX.A R11.1
N$39
  Top 0.5: U4.FEED L1.1 C10.2
N$40
  Top 0.5: U4.NC 67.65,16.8 67.65,11.05 61.25,11.05 61.25,13.45 R2.1
P0_0  (via drill 0.4)
  Top 0.254: v41.9,17.8 40.4,19.3 U3.16
  Bottom 0.254: TP12.TP 40.9,18.8 v41.9,17.8
P0_4/CTS_IN  (via drill 0.4)
  Top 0.254: v41.9,16.3 41.4,16.3 40.4,15.3 U3.18
  Bottom 0.254: v41.9,16.3 41.4,16.3 TP14.TP
P0_7/5  (via drill 0.4)
  Top 0.254: U3.21 40.6,9.3 41.1,9.8 41.1,11.2 46.1,16.2 v46.1,16.3
  Bottom 0.254: v46.1,16.3 46.1,15 TP16.TP
PWRIN
  Top 0.61: J1.PWR 12.5,8 16.8,3.7 16.8,2.9 17.4,2.3 D6.A
RD_N  (via drill 0.3, 0.4)
  Top 0.254: v44.7,16.3 44.7,15.59 TP17.TP 40.4,11.3 U3.20 38.95,11.3 38.2,12.05 35.8,12.05 34.41,10.65 28.7,10.65 26.95,12.39 26.95,17.39 20.09,24.25 16.3,24.25 15.05,25.5 v15.05,36.9 | R5.2 14.64,39.2 v15,38.84
  Bottom 0.254: v44.7,16.3 44.7,15.6 TP17.TP | v15,38.84 15,36.95 v15.05,36.9
RD_P  (via drill 0.4)  (1 unrouted)
  Top 0.254: v43.3,16.3 43.3,16.2 TP15.TP 41.89,14.79 40.4,13.3 U3.19 38.95,13.3 38.2,12.55 35.59,12.55 34.2,11.15 28.91,11.15 27.45,12.61 27.45,17.61 22.13,22.93 arc-90 22.13,23.29 22.14,23.3 arc90 22.14,23.66 22.13,23.67 arc90 21.77,23.67 21.76,23.66 arc-90 21.4,23.66 21.39,23.67 arc-90 21.39,24.03 21.4,24.04 arc90 21.4,24.4 21.39,24.41 arc90 21.03,24.41 21.02,24.4 arc-90 20.66,24.4 20.3,24.75 16.5,24.75 15.55,25.7 15.55,36 15.9,36.35 15.9,37.45 15.55,37.8 R4.2
  Bottom 0.254: v43.3,16.3 43.3,16.2 TP15.TP
RESET  (via drill 0.4, 0.5)
  Top 0.254: ZU4.1 57.3,38.53 v57.3,34.3 | POWER1.3 33.02,6.52 v34,7.5 | v35,25.6 34.3,25.6 34,25.9 34,27.7 32.8,28.9 18.3,28.9 17.8,29.4 v17.8,30 | v35,25.6 39.1,25.6 39.8,26.3 40.8,26.3 42.6,28.1 60.6,28.1 63.3,25.4 ISP.5 | S1.1 10.55,50.55 11.62,49.48 11.62,46.9 12.33,46.2 R10.2 | 14.2,45.7 14.25,45.75 | 14.25,45.75 14.15,45.85 | v16.82,44.18 15.3,45.7 D5.A 14.25,45.75 | v35,25.6 34.24,24.84 RESET-EN.2 RESET-EN.1 35.76,24.16 36.7,25.1 39.4,25.1 40,25.7 C5.2
  Top 0.305: R10.2 13.8,46.2 D5.A
  Bottom 0.254: v57.3,34.3 57.6,34 58.1,34 61.5,30.6 61.5,27.2 63.3,25.4 ISP.5 | v34,7.5 34,19.5 35,20.5 v35,25.6 | v17.8,30 17.8,31.5 18.2,31.9 18.2,42.8 v16.82,44.18
SCK  (via drill 0.5)
  Top 0.254: v17.2,28 30.8,28 v31.1,27.7 | v15.7,20.3 15.7,18.3 16.18,17.82
  Top 0.305: U5.5 16.18,17.82
  Bottom 0.254: 31.39,27.41 ZU4.19 34.42,35.02 35,35.6 57.6,35.6 62.1,31.1 62.1,29.3 | 31.39,27.41 30.98,27 22.4,27 20.6,28.8 20.6,40.4 23.6,43.4 25.6,43.4 27.4,45.2 28.7,45.2 28.96,45.46 IOH1.6 | v15.7,20.3 14.6,21.4 13.9,21.4 13.4,21.9 13.4,27.3 14.1,28 v17.2,28 | v31.1,27.7 31.39,27.41 | 62.1,29.29 62.1,29.3 | 62.1,29.3 63.46,27.94 ISP.3
SRF_CSN  (via drill 0.4)
  Top 0.254: U3.14 41.9,20.7 v43.3,19.3
  Bottom 0.254: v43.3,19.3 41.91,20.69 | 41.91,20.69 41.9,20.7 | TP10.TP 41.91,20.69
SRF_DC  (via drill 0.4, 0.5)
  Top 0.254: v37.2,15.6 37,15.6 36.4,15 32.6,15 31.9,15.7 SRF.3 | U3.6 51.9,7.5 51.9,7.9 51.9,8.1 51.6,8.4 50.7,8.4 48.1,11 v48.1,11.4
  Bottom 0.254: v37.2,15.6 38.1,14.7 38.1,14.1 39.6,12.6 44.9,12.6 45.2,12.9 46.8,12.9 48.1,11.6 v48.1,11.4 48.1,10 TP4.TP
SRF_DD  (via drill 0.4, 0.5)
  Top 0.15: 31.7,14.7 29.95,14.7
  Top 0.254: U3.5 49.9,7.8 v46.9,10.8 | v37.2,14.2 36.6,14.2 36.4,14.4 32,14.4 31.7,14.7 | 29.95,14.7 29.1,15.55 SRF.4
  Bottom 0.254: v37.2,14.2 39.35,12.05 45.65,12.05 TP5.TP v46.9,10.8
SRF_MISO  (via drill 0.4)
  Top 0.254: v40.6,7.3 41.85,7.3 U3.1
  Bottom 0.254: v40.6,7.3 40.6,9.1 TP9.TP
SRF_MOSI  (via drill 0.4)
  Top 0.254: v45.2,19.8 45.9,20.5 U3.12 45.9,24.09 44.99,25 40.3,25 38.3,23 37.6,23 36.7,22.1 32.35,22.1 31.8,22.65 R12.2
  Bottom 0.254: v45.2,19.8 45.9,20.5 TP8.TP
SRF_RESET  (via drill 0.4)
  Top 0.254: U3.15 39.2,21.3 38.55,20.65 38.55,19.6 37.95,19 37.4,19 37,18.6 32.4,18.6 31.5,17.7 SRF.5 | U3.15 40.01,21.3 | U3.15 39.9,21.3 v41.9,19.3
  Bottom 0.254: v41.9,19.3 40.4,20.8 TP3.TP
SRF_RX  (via drill 0.4, 0.5)
  Top 0.254: R13.1 53.5,40.5 v53.5,34.3 | U3.2 43.9,7.7 v42.9,8.7 42.9,8.8 47.05,12.95 54.05,12.95 54.15,12.95 v54.95,13.75
  Bottom 0.254: TP7.TP 42.9,8.8 v42.9,8.7 | v53.5,34.3 55.1,32.7 57.8,32.7 58.9,31.6 58.9,28.4 55.35,24.85 55.35,14.15 v54.95,13.75
SRF_SCLK  (via drill 0.4)
  Top 0.254: v44.6,18.7 44.3,19 44.3,20.4 TP11.TP U3.13 43.9,24.09 43.59,24.4 40.5,24.4 38.5,22.4 37.8,22.4 36.95,21.55 32.55,21.55 32.2,21.2 R11.2
  Bottom 0.254: v44.6,18.7 44.3,19 44.3,20.4 TP11.TP 43.9,21
SRF_TX  (via drill 0.4, 0.5)
  Top 0.254: v55.9,34.3 56,34.4 56,40.7 R14.1 | U3.3 45.9,7.74 v45,8.64 45,10.1 47.3,12.4 55.5,12.4 v55.9,12.8
  Bottom 0.254: v55.9,34.3 56.8,33.4 57.9,33.4 59.5,31.8 59.5,28.2 55.9,24.6 v55.9,12.8 | TP6.TP 45,8.7 v45,8.64
SS
  Bottom 0.254: ZU4.16 25.16,28.8 23.3,28.8 22.4,29.7 22.4,39.6 24.4,41.6 26.4,41.6 28.2,43.4 34.2,43.4 36.58,45.78 IOH1.3
USB_ENABLE  (via drill 0.4, 0.5)
  Top 0.15: v48.1,5.75 48.1,4.4 47.85,4.15 v47.85,3.45
  Top 0.254: U3.4 47.9,5.95 v48.1,5.75 | R1.2 14,36.5 14.5,36 14.5,25.2 16,23.7 19.8,23.7 26.4,17.1 26.4,12.2 28.5,10.1 31.7,10.1 v32.2,9.6
  Bottom 0.15: 32.2,7.15 33.2,6.15 38.45,6.15 39.3,5.3 46.35,5.3 47.85,3.8 v47.85,3.45
  Bottom 0.254: v48.1,5.75 47.9,5.95 47.9,7.8 TP18.TP | v32.2,9.6 32.2,7.15
USBVCC
  Top 0.61: F1.1 5.16,24.55 T1.1
VIN  (via drill 0.5)
  Top 0.305: R7.2 18.7,19.7 v18,20.4
  Top 0.61: U1.3 12.39,19.71 v13.8,18.3 13.8,11.1 18.17,6.73 18.17,4.33 D6.C PC1.1 21,4.8 21,7.2 22.05,8.26 v22.1,8.26
  Bottom 0.305: v18,20.4 18,19.3 17.1,18.3 v13.8,18.3
  Bottom 0.61: v22.1,8.26 23.75,8.26 26.57,5.44 38.11,5.44 38.92,4.62 45.03,4.62 45.72,3.94 POWER1.8
XTAL1
  Top 0.254: ZU4.9 36.7,38.81 Q1.3
XTAL2
  Top 0.254: ZU4.10 34.7,38.84 Q1.1
XUSB  (1 unrouted)
  Top 0.406: 4.2,28.45 4.2,34.9 3.4,35.7 3.4,40.7 4,41.3 5.7,41.3 7.3,39.7
  Top 0.61: F1.2 4.2,28.45

### Text on the board
Bottom: IOT Research
tPlace: SCL | SDA | AREF | GND | 13 | 12 | 11 | 10 | 9 | 8 | 7 | 6 | 5 | 4 | 3 | 2 | 1 | 0 | # | # | # | # | # | # | TX | RX | IOREF | RESET | 3V3 | 5V | GND | VIN | A0 | A1 | A2 | A3 | A4 | A5
bPlace: Designed by | Relased Under CC-BY | 433MHz | 868MHz | 915MHz | Derived from the | Aruidno UNO R3 Design | By Arduino.cc | RoHS
Document: v1.5 | L | ON | c | 2014 | RF-EN | 1 | ICSP | xino RF | B008 | RXR | RESET-EN | TXR | 1
214bmp: D:/SmartProjects/Snc/a4_bn_logo2.bmp